# EAGLE design lucid_glasses (EAGLE 6.1)
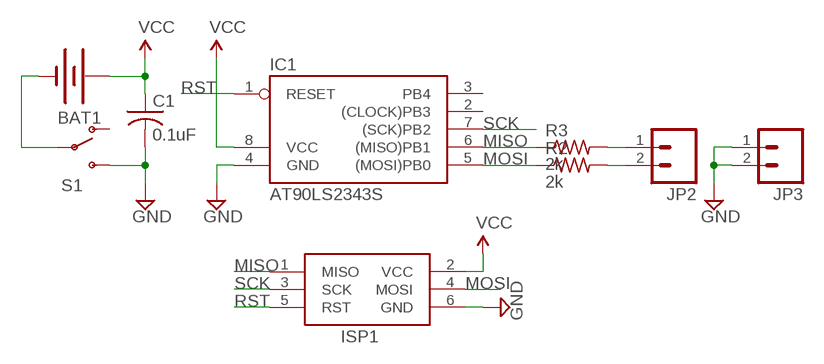
[diagram p0: schematic, sheet 1]

## Parts
BAT1  BATTERY20SMD  [BATTCON_20MM]
C1  0.1uF  C-USC1206  [C1206]
IC1  AT90LS2343S  [SOIC8]
ISP1  AVRISP-6  [AVRISP]
JP2  M02PTH  [1X02]
JP3  M02PTH  [1X02]
R2  2k  R-US_R1206  [R1206]
R3  2k  R-US_R1206  [R1206]
S1  SWITCH-SPSTSMD2  [SWITCH-SPDT-SMD]

## Nets
GND: C1.2 IC1.4(GND) ISP1.6(GND) JP3.1 JP3.2 S1.3(S)
MISO: IC1.6((MISO)PB1) ISP1.1(MISO) R3.1
MOSI: IC1.5((MOSI)PB0) ISP1.4(MOSI) R2.1
N$1: JP2.1 R3.2
N$2: BAT1.2(-) S1.2(P)
N$4: JP2.2 R2.2
RST: IC1.1(RESET) ISP1.5(RST)
SCK: IC1.7((SCK)PB2) ISP1.3(SCK)
VCC: BAT1.1(+) C1.1 IC1.8(VCC) ISP1.2(VCC)
Unconnected: IC1.2((CLOCK)PB3) IC1.3(PB4) S1.1(O)

## Library data of the parts
BAT1 = sparkfun:BATTERY: Battery Holders Various common sizes : AA, AAA, 20mm coin cell and 12mm coin cell.
C1 = adafruit:C-US: CAPACITOR, American symbol
IC1 = atmel:AT90*2343: MICROCONTROLLER 2 Kbytes FLASH 128 bytes SRAM 128 bytes EEPROM
ISP1 = adafruit:AVRISP: AVR ISP HEADER Standard 6 pin header for AVR programming
JP2 JP3 = sparkfun:M02: Header 2 Standard 2-pin 0.1" header. Use with straight break away headers (SKU : PRT-00116), right angle break away headers (PRT-00553), swiss pins (PRT-00743), machine pins (PRT-00117), and female headers (PRT-00115). Molex polarized connector foot print use with SKU : PRT-08233 with associated crimp pins and housings.
R2 R3 = resistor:R-US_: RESISTOR, American symbol
S1 = sparkfun:SWITCH-SPST: SPST Switch Simple slide switch. Spark Fun Electronics SKU : COM-00102

## Board
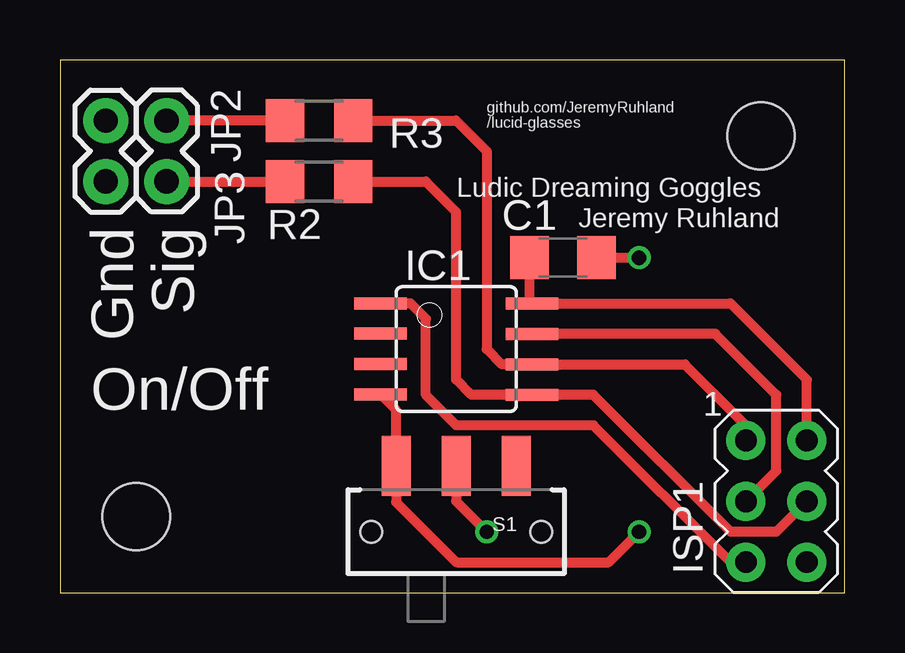
[diagram p1: board, top side]
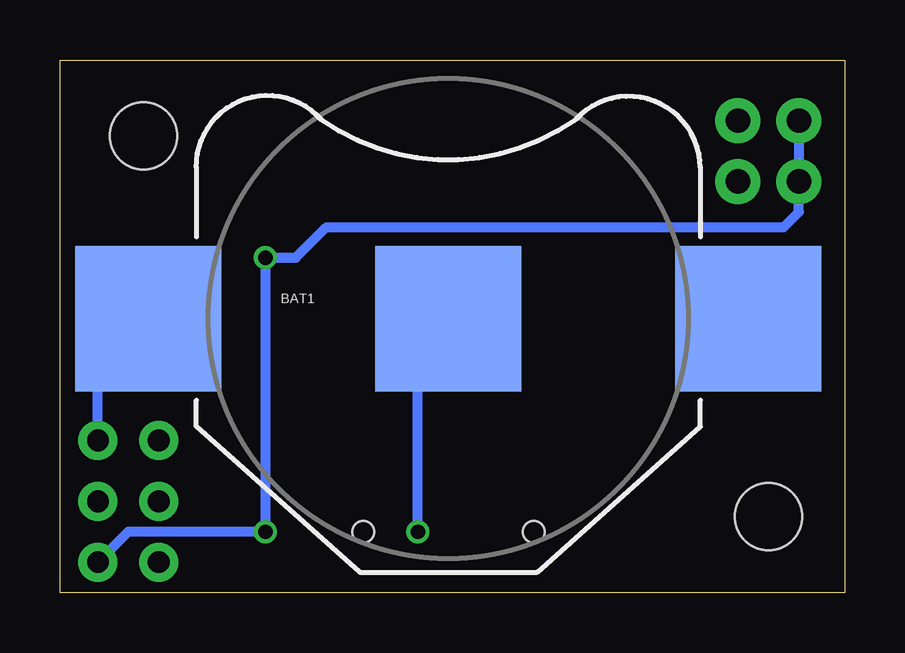
[diagram p2: board, bottom side, seen from below]

Size 32.69 x 22.21 mm. Coordinates in mm from the lower left corner, seen from the top.
Outline: 0,0 32.69,0 32.69,22.21 0,22.21 0,0
Copper layers (1*16): Top 0.0356mm / dielectric 1.5011mm / Bottom 0.0356mm
Design rules: minimum track width 6mil, minimum drill 13mil, track to track 6mil, track to pad 6mil, pad to pad 6mil, via to via 6mil, smd to smd 6mil, copper to edge 15mil, drill to drill 6mil, minimum pad ring 7mil, minimum via ring 7mil, stop-mask expansion 4mil, vias tented up to drill 0mil, thermal gap 10mil
Holes 2.8 mm at 29.21,19.05 3.17,3.17

### Footprints (pad centres in the part's own frame; a part is rotated, then mirrored left to right if it is on the bottom)
BATTCON_20MM = smd 6.07 x 6.07: 1 -12.5,0; 2 0,0; 3 12.5,0
C1206 = smd 1.6 x 1.8: 1 -1.4,0; 2 1.4,0
SOIC8 = smd 0.5 x 2.2: 1 -1.905,-3.154; 2 -0.645,-3.154; 3 0.625,-3.154; 4 1.895,-3.154; 5 1.905,3.154; 6 0.635,3.154; 7 -0.635,3.154; 8 -1.905,3.154
AVRISP = drill 0.9 pad 1.626: 1 -1.27,2.54; 2 1.27,2.54; 3 -1.27,0; 4 1.27,0; 5 -1.27,-2.54; 6 1.27,-2.54
1X02 = drill 1.016 pad 1.88: 1 0,0; 2 2.54,0
R1206 = smd 1.6 x 1.803: 1 -1.422,0; 2 1.422,0
SWITCH-SPDT-SMD = smd 1.2 x 2.5: 1 -2.5,-2.75; 2 0,-2.75; 3 2.5,-2.75 | hole 0.9: -3.55,0; 3.55,0

### Placement (x,y rotation side)
BAT1  16.51,11.43 0 bottom
C1  20.95,13.97 0 top
IC1  16.51,10.16 270 top
ISP1  29.84,3.81 0 top
JP2  4.44,19.69 270 top
JP3  1.9,17.14 90 top
R2  10.79,17.14 180 top
R3  10.79,19.69 180 top
S1  16.51,2.54 180 top

### Tracks (layer width: path | path; a pad name or v marks a point on that pad's centre or on a via)
GND  (via drill 0.6)
  Top 0.406: C1.2 v24.13,13.97 | IC1.4 14.01,7.61 S1.3 14.01,3.77 16.51,1.27 22.86,1.27 v24.13,2.54
  Bottom 0.406: JP3.2 JP3.1 1.9,15.88 2.54,15.24 21.59,15.24 22.86,13.97 v24.13,13.97 v24.13,2.54 29.84,2.54 ISP1.6
MISO
  Top 0.406: ISP1.1 28.57,6.99 26.04,9.53 IC1.6 18.41,9.53 17.78,10.16 17.78,18.41 16.51,19.69 R3.1
MOSI
  Top 0.406: ISP1.4 29.84,2.54 27.94,2.54 22.23,8.26 IC1.5 17.14,8.26 16.51,8.89 16.51,15.88 15.24,17.14 R2.1
N$1
  Top 0.406: R3.2 JP2.1
N$2  (via drill 0.6)
  Top 0.406: S1.2 16.51,3.81 v17.78,2.54
  Bottom 0.406: v17.78,2.54 17.78,10.16 BAT1.2
N$4
  Top 0.406: JP2.2 R2.2
RST
  Top 0.406: ISP1.5 27.94,1.27 22.23,6.99 16.51,6.99 15.24,8.26 15.24,11.43 14.61,12.06 IC1.1
SCK
  Top 0.406: ISP1.3 29.84,5.08 29.84,8.26 27.3,10.79 IC1.7
VCC
  Top 0.406: C1.1 19.55,12.17 IC1.8 27.94,12.06 31.11,8.89 ISP1.2
  Bottom 0.406: ISP1.2 31.11,9.32 BAT1.1

### Text on the board
_tsilk: github.com/JeremyRuhland | /lucid-glasses | Ludic Dreaming Goggles | Gnd | Sig | Jeremy Ruhland | On/Off